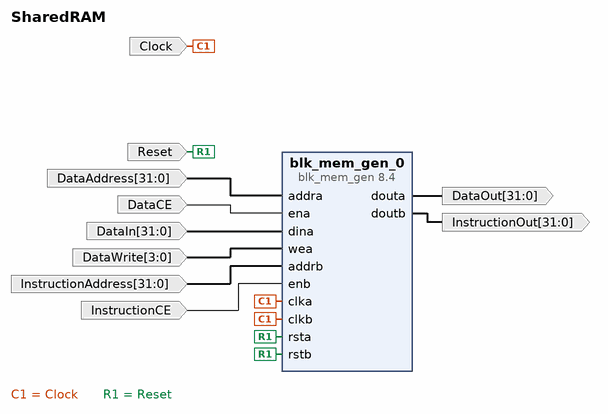
[diagram p0: block diagram of the top level]
# Vivado block design SharedRAM, xc7a35ticsg324-1L, Vivado 2022.2
create_bd_design SharedRAM

create_bd_port -dir I -from 31 -to 0 -type data DataAddress
create_bd_port -dir I -type ce DataCE
create_bd_port -dir I -type clk Clock
set_property -dict {CONFIG.FREQ_HZ 100000000} [get_bd_ports Clock]
create_bd_port -dir I -from 31 -to 0 -type data DataIn
create_bd_port -dir O -from 31 -to 0 -type data DataOut
create_bd_port -dir I -from 3 -to 0 -type data DataWrite
create_bd_port -dir I -type rst Reset
set_property -dict {CONFIG.POLARITY ACTIVE_HIGH} [get_bd_ports Reset]
create_bd_port -dir I -from 31 -to 0 -type data InstructionAddress
create_bd_port -dir I -type ce InstructionCE
create_bd_port -dir O -from 31 -to 0 -type data InstructionOut

create_bd_cell -type ip -vlnv xilinx.com:ip:blk_mem_gen:8.4 blk_mem_gen_0
set_property -dict [list \
  CONFIG.Assume_Synchronous_Clk true \
  CONFIG.EN_SAFETY_CKT false \
  CONFIG.Memory_Type True_Dual_Port_RAM \
] [get_bd_cells blk_mem_gen_0]

# ---- connections ----

connect_bd_net [get_bd_ports Clock] [get_bd_pins blk_mem_gen_0/clka] [get_bd_pins blk_mem_gen_0/clkb]
connect_bd_net [get_bd_ports DataAddress] [get_bd_pins blk_mem_gen_0/addra]
connect_bd_net [get_bd_ports DataCE] [get_bd_pins blk_mem_gen_0/ena]
connect_bd_net [get_bd_ports DataIn] [get_bd_pins blk_mem_gen_0/dina]
connect_bd_net [get_bd_ports DataWrite] [get_bd_pins blk_mem_gen_0/wea]
connect_bd_net [get_bd_ports InstructionAddress] [get_bd_pins blk_mem_gen_0/addrb]
connect_bd_net [get_bd_ports InstructionCE] [get_bd_pins blk_mem_gen_0/enb]
connect_bd_net [get_bd_ports Reset] [get_bd_pins blk_mem_gen_0/rsta] [get_bd_pins blk_mem_gen_0/rstb]
connect_bd_net [get_bd_pins blk_mem_gen_0/douta] [get_bd_ports DataOut]
connect_bd_net [get_bd_pins blk_mem_gen_0/doutb] [get_bd_ports InstructionOut]

validate_bd_design
save_bd_design
